# EAGLE design Lora G v1.3 (EAGLE 7.5.0)

## Sheet 1 of 2
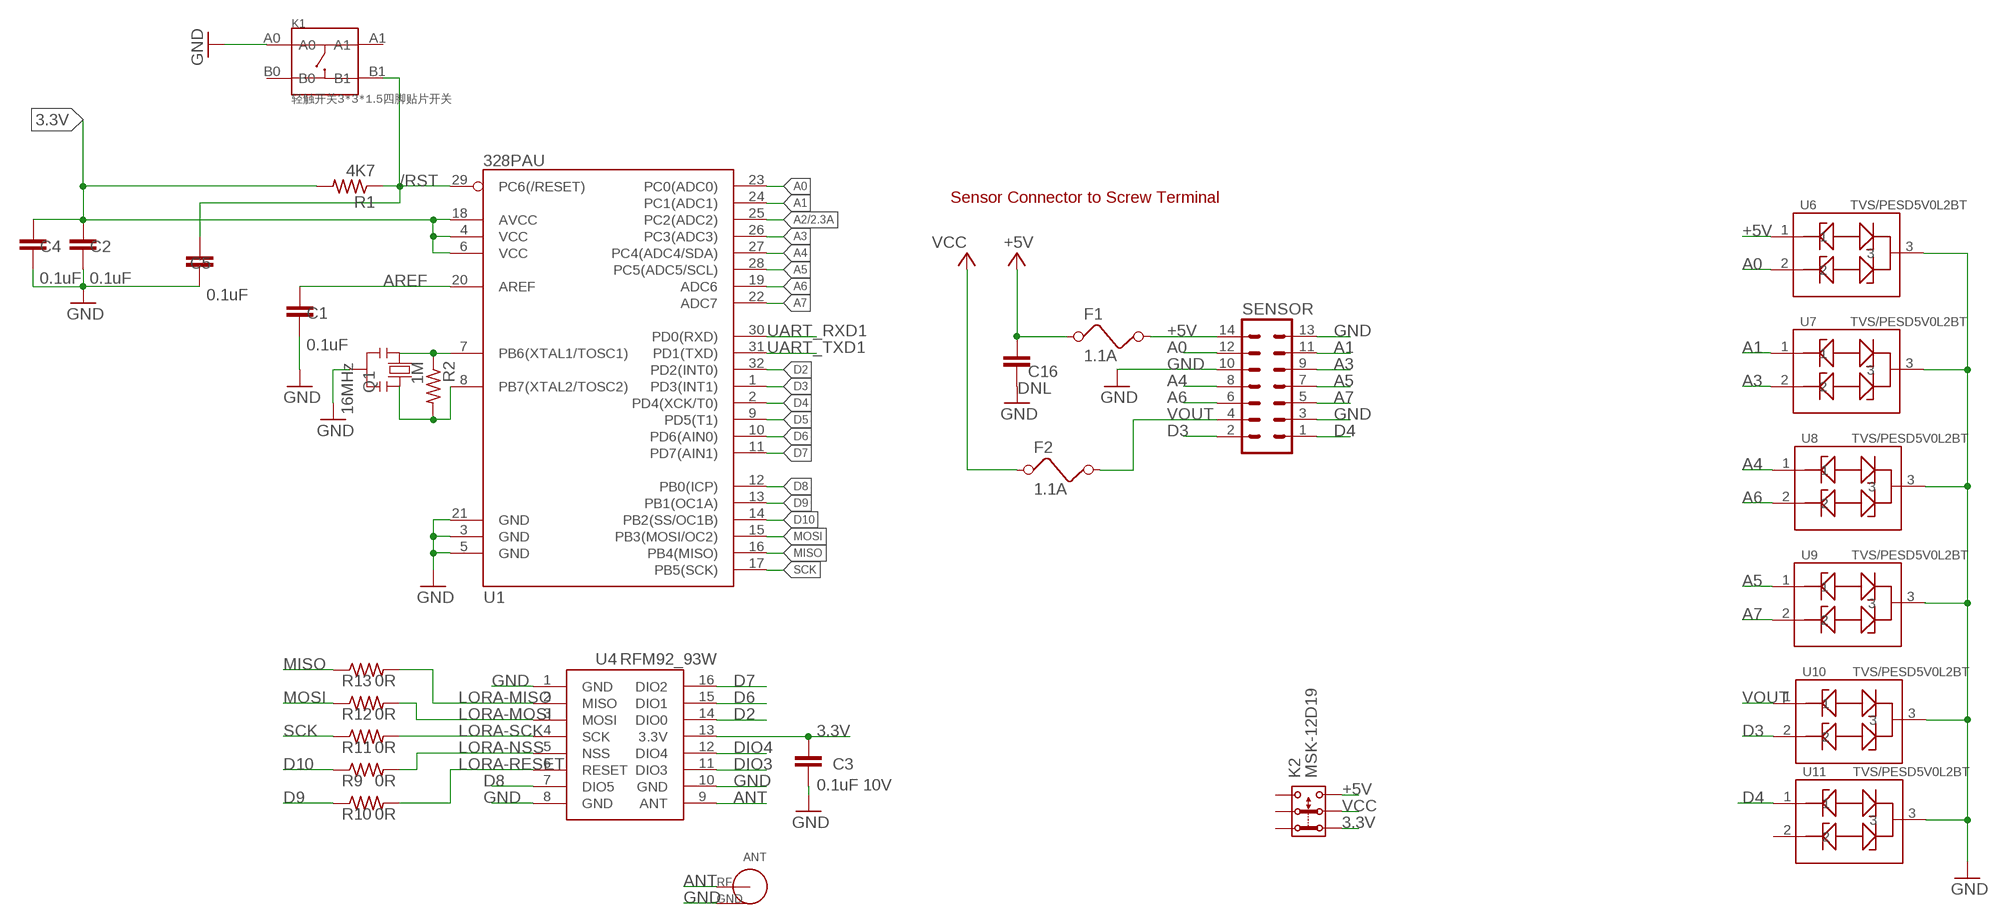
[diagram p0: schematic, sheet 1]

### Parts
ANT  I-PEX  [I-PEX]
C1  0.1uF  C-EUC0402  [C0402]
C2  0.1uF  C-EUC0402  [C0402]
C3  0.1uF 10V  C-EUC0402  [C0402]
C4  0.1uF  C-EUC0402  [C0402]
C5  0.1uF  C-EUC0402  [C0402]
C16  DNL  C-EUC0402  [C0402]
F1  1.1A  FUSE1812  [L1812]
F2  1.1A  FUSE1812  [L1812]
K1  轻触开关3*3*1.5四脚贴片开关  BUTTON-4P-3.3X3.3  [SW4-SMD-3.35X3.35X1.5MM]
K2  MSK-12D19  [MSK-12D19]
Q1  16MHz  RESONATORMU  [RESONATOR]
R1  4K7  R-US_R0402  [R0402]
R2  1M  R-US_R0402  [R0402]
R9  0R  R-US_R0402  [R0402]
R10  0R  R-US_R0402  [R0402]
R11  0R  R-US_R0402  [R0402]
R12  0R  R-US_R0402  [R0402]
R13  0R  R-US_R0402  [R0402]
SENSOR  MA07-2  [MA07-2]
U1  328PAU  [328PAU]
U4  RFM92_93W  [RFM92_93W]
U6  TVS/PESD5V0L2BT  [SOT23]
U7  TVS/PESD5V0L2BT  [SOT23]
U8  TVS/PESD5V0L2BT  [SOT23]
U9  TVS/PESD5V0L2BT  [SOT23]
U10  TVS/PESD5V0L2BT  [SOT23]
U11  TVS/PESD5V0L2BT  [SOT23]

### Nets
3.3V: C2.2 C3.2 C4.2 K2.1.2 R1.2 U1.4(VCC) U1.6(VCC) U1.18(AVCC) U4.13(3.3V) ; also sheet 2
+5V: C16.1 F1.1 K2.3.2 U6.1 ; also sheet 2
/RST: C5.2 K1.B1 R1.1 U1.29(PC6(/RESET)) ; also sheet 2
A0: SENSOR.12 U1.23(PC0(ADC0)) U6.2
A1: SENSOR.11 U1.24(PC1(ADC1)) U7.1
A2: U1.25(PC2(ADC2)) ; also sheet 2
A3: SENSOR.9 U1.26(PC3(ADC3)) U7.2
A4: SENSOR.8 U1.27(PC4(ADC4/SDA)) U8.1
A5: SENSOR.7 U1.28(PC5(ADC5/SCL)) U9.1
A6: SENSOR.6 U1.19(ADC6) U8.2
A7: SENSOR.5 U1.22(ADC7) U9.2
ANT [2layer-50ohm]: ANT.SIG U4.9(ANT)
AREF: C1.2 U1.20(AREF)
D2: U1.32(PD2(INT0)) U4.14(DIO0)
D3: SENSOR.2 U1.1(PD3(INT1)) U10.2
D4: SENSOR.1 U1.2(PD4(XCK/T0)) U11.1
D5: U1.9(PD5(T1)) ; also sheet 2
D6: U1.10(PD6(AIN0)) U4.15(DIO1)
D7: U1.11(PD7(AIN1)) U4.16(DIO2)
D8: U1.12(PB0(ICP)) U4.7(DIO5)
D9: R10.1 U1.13(PB1(OC1A))
D10: R9.1 U1.14(PB2(SS/OC1B)) ; also sheet 2
DIO3: U4.11(DIO3)
DIO4: U4.12(DIO4)
GND [vcc]: ANT.GND ANT.GND1(GND) C1.1 C2.1 C3.1 C4.1 C5.1 C16.2 K1.A0 Q1.2 SENSOR.3 SENSOR.10 SENSOR.13 U1.3(GND) U1.5(GND) U1.21(GND) U4.1(GND) U4.8(GND) U4.10(GND) U6.3 U7.3 U8.3 U9.3 U10.3 U11.3 ; also sheet 2
LORA-MISO: R13.2 U4.2(MISO)
LORA-MOSI: R12.2 U4.3(MOSI)
LORA-NSS: R9.2 U4.5(NSS)
LORA-RESET: R10.2 U4.6(RESET)
LORA-SCK: R11.2 U4.4(SCK)
MISO: R13.1 U1.16(PB4(MISO)) ; also sheet 2
MOSI: R12.1 U1.15(PB3(MOSI/OC2)) ; also sheet 2
N$1: Q1.3 R2.2 U1.8(PB7(XTAL2/TOSC2))
N$2: Q1.1 R2.1 U1.7(PB6(XTAL1/TOSC1))
N$5: F1.2 SENSOR.14
SCK: R11.1 U1.17(PB5(SCK)) ; also sheet 2
UART_RXD1: U1.30(PD0(RXD)) ; also sheet 2
UART_TXD1: U1.31(PD1(TXD)) ; also sheet 2
VCC: F2.1 K2.2.2
VOUT: F2.2 SENSOR.4 U10.1
Unconnected: K1.A1 K1.B0 K2.1.1 K2.2.1 K2.3.1 U11.2

### Notes on the sheet
- Sensor Connector to Screw Terminal

## Sheet 2 of 2
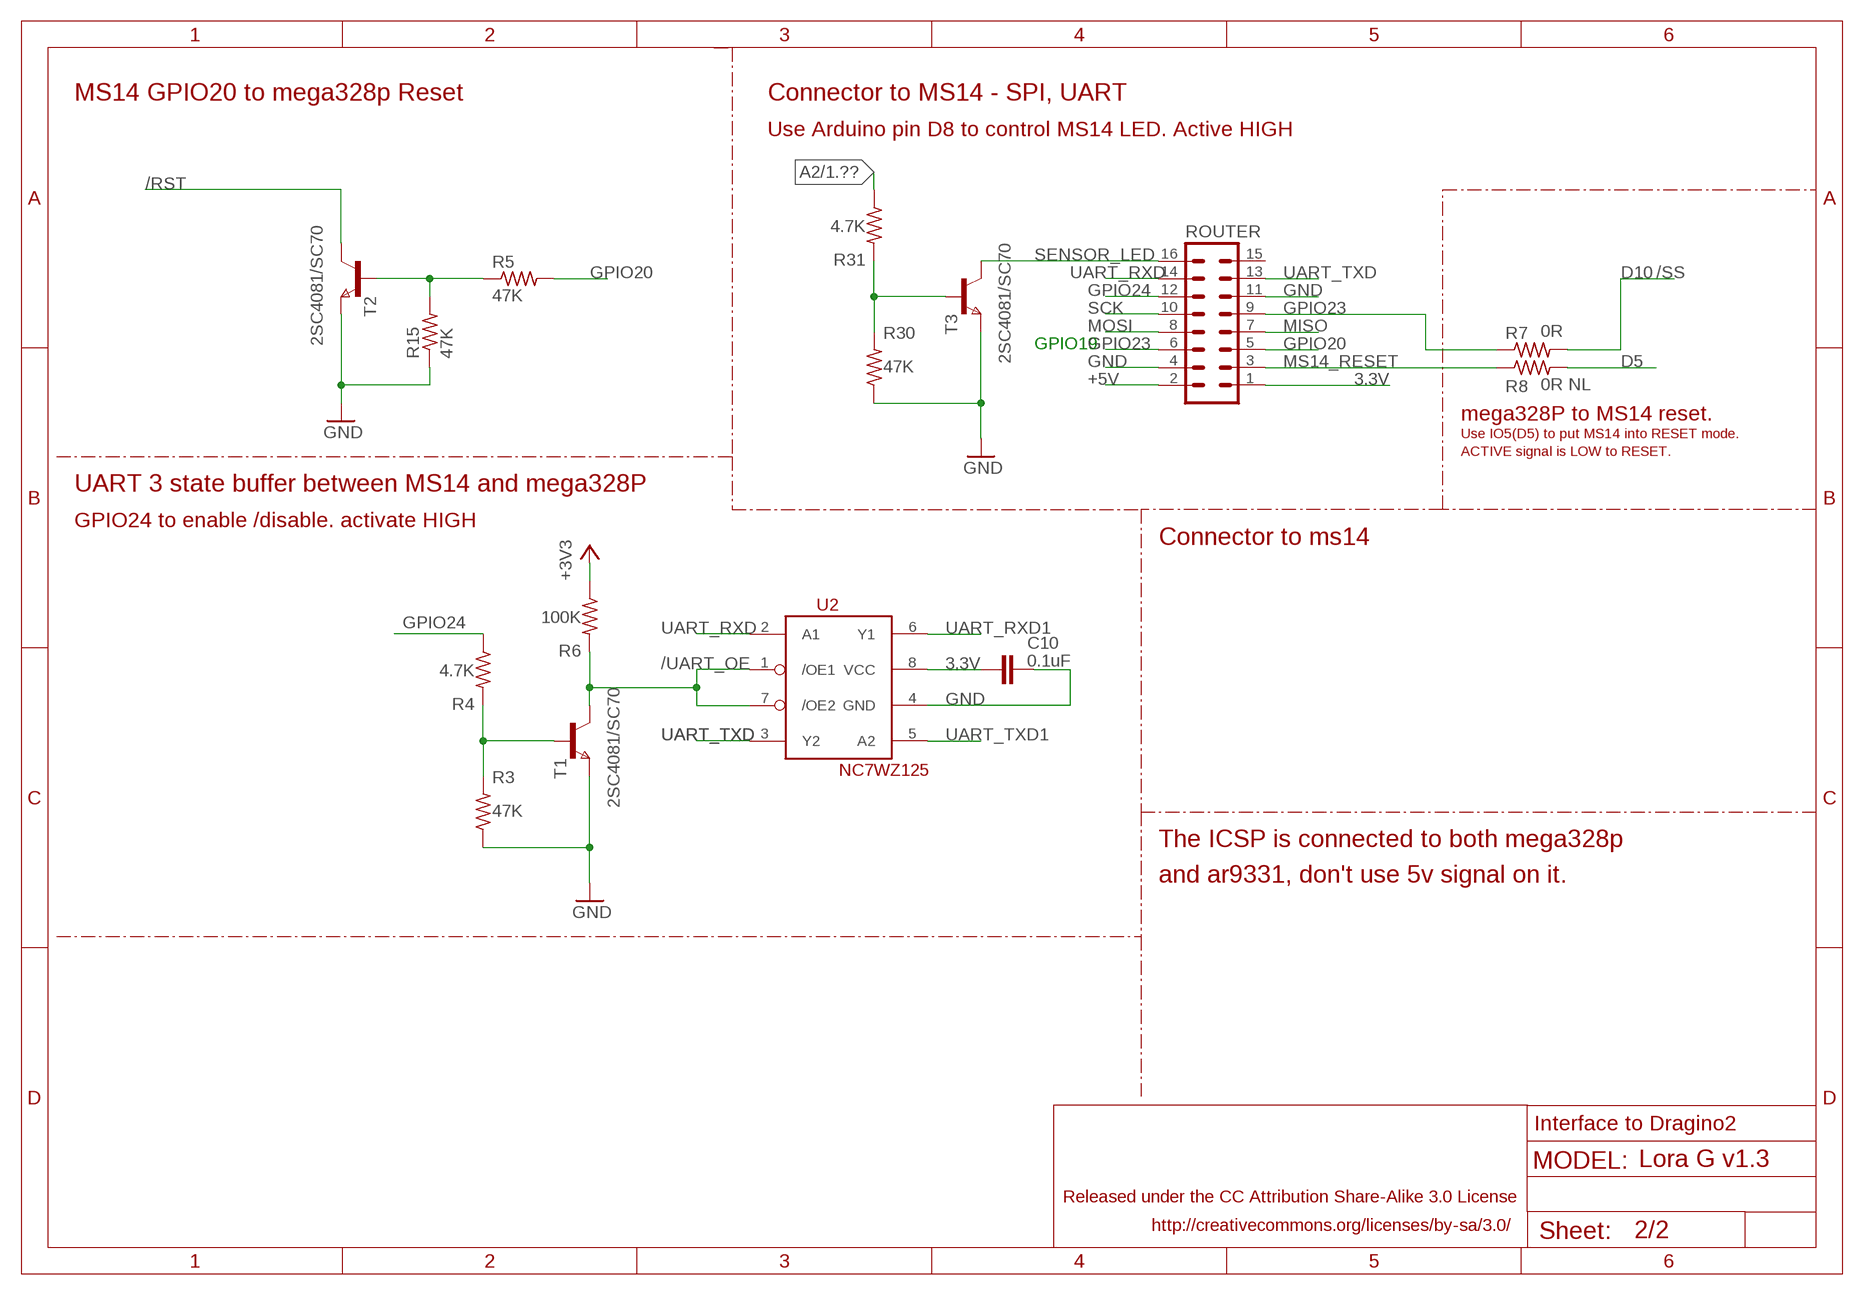
[diagram p1: schematic, sheet 2]

### Parts
C10  0.1uF  C-EUC0402  [C0402]
R3  47K  R-US_R0402  [R0402]
R4  4.7K  R-US_R0402  [R0402]
R5  47K  R-US_R0402  [R0402]
R6  100K  R-US_R0402  [R0402]
R7  0R  R-US_R0402  [R0402]
R8  0R NL  R-US_R0805  [R0805]
R15  47K  R-US_R0402  [R0402]
R30  47K  R-US_R0402  [R0402]
R31  4.7K  R-US_R0402  [R0402]
ROUTER  MA08-2  [MA08-2]
T1  2SC4081/SC70  NPNSOT323  [SOT323]
T2  2SC4081/SC70  NPNSOT323  [SOT323]
T3  2SC4081/SC70  NPNSOT323  [SOT323]
U2  NC7WZ125  [US8]

### Nets
3.3V: C10.2 R6.1 ROUTER.1 U2.8(VCC) ; supply symbol labelled +3V3 ; also sheet 1
+5V: ROUTER.2 ; also sheet 1
/RST: T2.1(C) ; also sheet 1
/UART_OE: R6.2 T1.1(C) U2.1(/OE1) U2.7(/OE2)
A2: R31.1 ; also sheet 1
D5: R8.2 ; also sheet 1
D10: R7.2 ; also sheet 1
GND [vcc]: C10.1 R3.1 R15.1 R30.1 ROUTER.4 ROUTER.11 T1.3(E) T2.3(E) T3.3(E) U2.4(GND) ; also sheet 1
GPIO20: R5.2 ROUTER.5
GPIO23: R7.1 ROUTER.6 ROUTER.9
GPIO24: R4.1 ROUTER.12
MISO: ROUTER.7 ; also sheet 1
MOSI: ROUTER.8 ; also sheet 1
MS14_RESET: R8.1 ROUTER.3
N$4: R3.2 R4.2 T1.2(B)
N$8: R5.1 R15.2 T2.2(B)
N$9: R30.2 R31.2 T3.2(B)
SCK: ROUTER.10 ; also sheet 1
SENSOR_LED: ROUTER.16 T3.1(C)
UART_RXD: ROUTER.14 U2.2(A1)
UART_RXD1: U2.6(Y1) ; also sheet 1
UART_TXD: ROUTER.13 U2.3(Y2)
UART_TXD1: U2.5(A2) ; also sheet 1
Unconnected: ROUTER.15

### Notes on the sheet
- MS14 GPIO20 to mega328p Reset | Connector to MS14 - SPI, UART
- Use Arduino pin D8 to control MS14 LED. Active HIGH
- /SS
- GPIO19
- mega328P to MS14 reset.
- Use IO5(D5) to put MS14 into RESET mode.
- ACTIVE signal is LOW to RESET.
- UART 3 state buffer between MS14 and mega328P
- GPIO24 to enable /disable. activate HIGH
- Connector to ms14
- The ICSP is connected to both mega328p
- and ar9331, don't use 5v signal on it.
- Interface to Dragino2

## Library data of the parts
ANT = dragino-passive:I-PEX: I-PEX, U.F.L connector
C1-C5 = dragino-passive:C-EU: CAPACITOR, European symbol
C10 C16 = dragino:C-EU: CAPACITOR, European symbol
F1 F2 = dragino:FUSE: FUSE 5 x 20 mm
K1 = dragino:BUTTON-4P: SW4-6.0X6.0X5.0MM:311020024;SW4-8.0X8.0X9.0MM:311020028;SW4-SMD-6.0X6.0X5.0MM:311020004;SW4-SMD-3.35X3.35X1.5MM:311020030;SW4-SMD-5.2X5.2X2.5MM:311020046
K2 = dragino1:MSK-12D19
Q1 = SmartPrj:RESONATOR
R1-R13 R15 R30 R31 = dragino:R-US_: RESISTOR, American symbol
ROUTER = dragino:MA08-2: PIN HEADER; OC_FARNELL: unknown; OC_NEWARK: unknown
SENSOR = dragino:MA07-2: PIN HEADER; OC_FARNELL: unknown; OC_NEWARK: unknown
T1-T3 = zetex:NPNSOT323: NPN TRANSISTOR; MPN: DSS4160U-7; OC_FARNELL: 1710696; OC_NEWARK: 25R4558
U1 = 328PAU:328PAU
U2 = dragino:NC7WZ125: 3 state buffer: http://www.fairchildsemi.com/ds/NC/NC7WZ125.pdf
U4 = dragino:RFM92_93W
U6-U11 = dragino-passive:TVS/PESD5V0L2BT

## Net classes
0 default: width 0.203 mm, clearance 0.203 mm
1 vcc: width 0.254 mm
2 gnd: width 0.305 mm, drill 0.254 mm, clearance 0.203 mm
3 2layer-50ohm: width 1 mm, clearance 0.2 mm

## Board
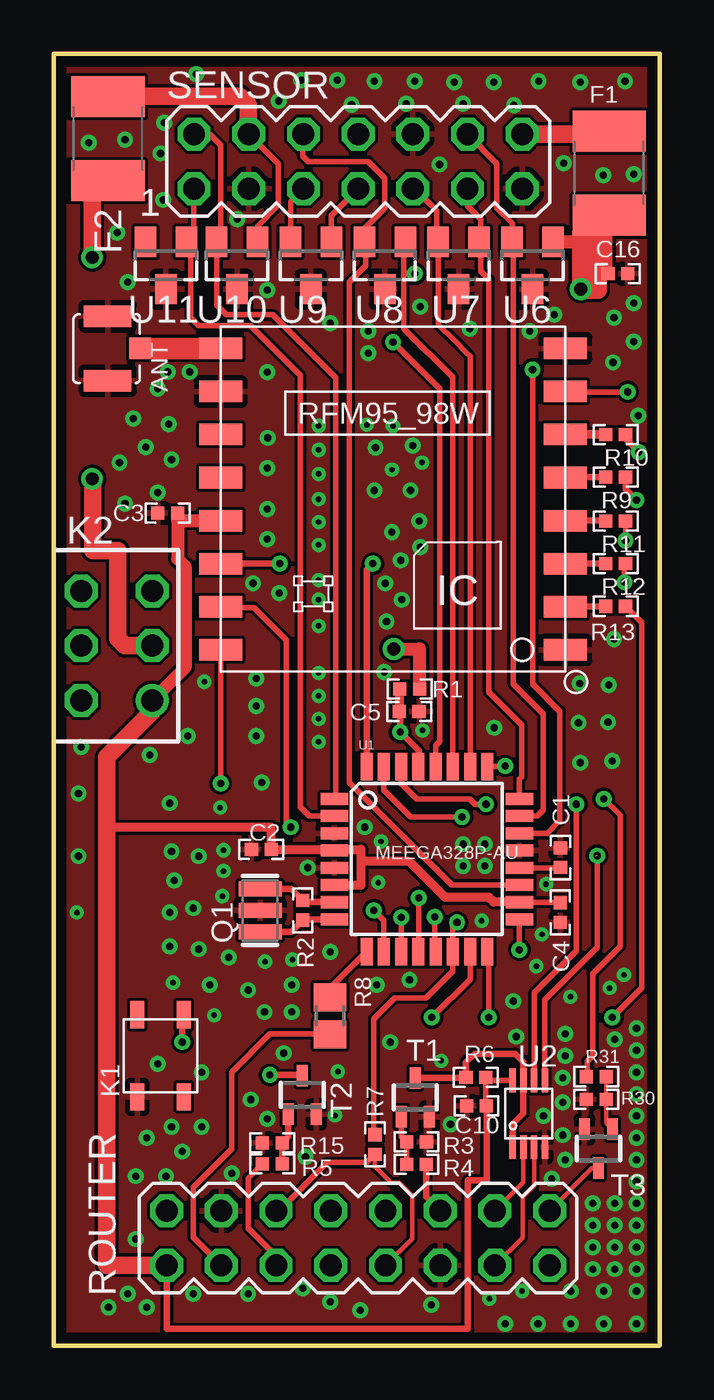
[diagram p2: board, top side]
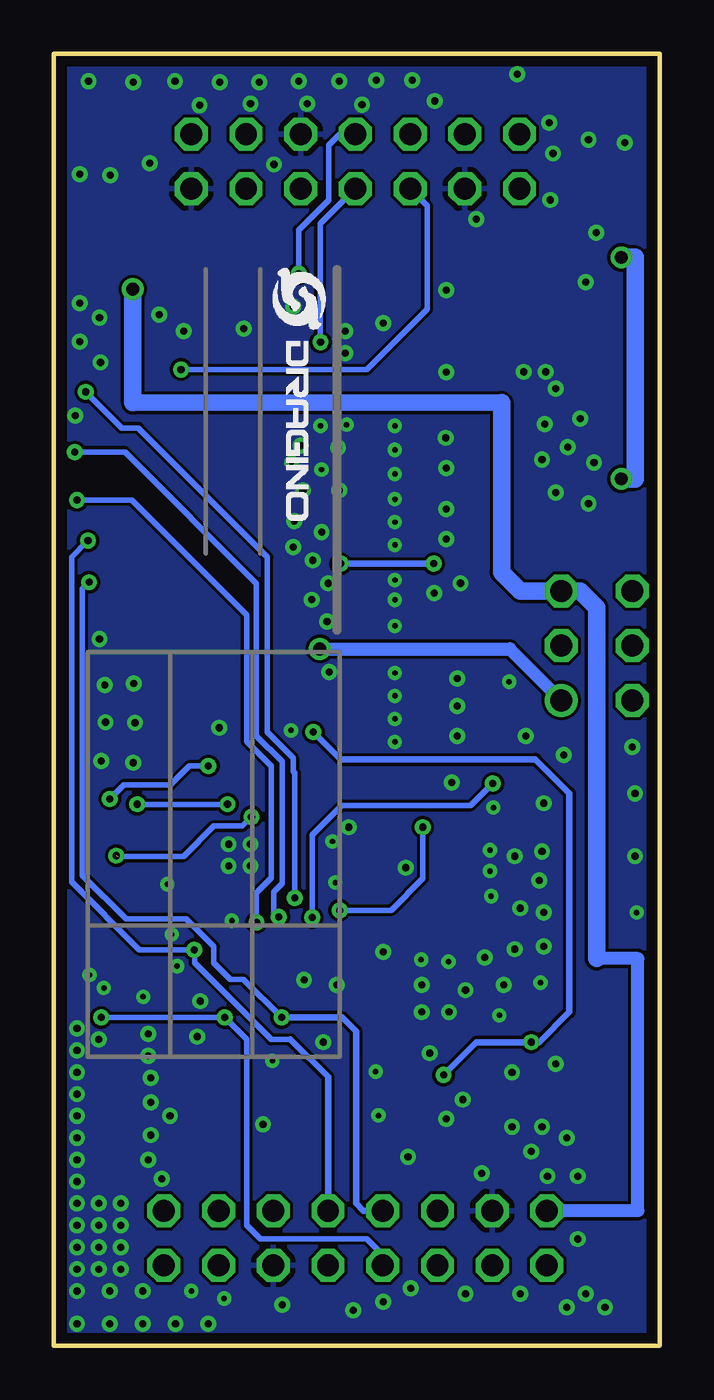
[diagram p3: board, bottom side, seen from below]

Size 28.13 x 60 mm. Coordinates in mm from the lower left corner, seen from the top.
Outline: 0,0 0,60 28.13,60 28.13,0 0,0
Copper layers (1*16): Top 0.035mm / dielectric 1.5mm / Bottom 0.035mm
Design rules "default *": minimum track width 6mil, minimum drill 10mil, track to track 6mil, track to pad 6mil, pad to pad 6mil, via to via 6mil, smd to smd 6mil, copper to edge 0.5mm, drill to drill 8mil, minimum pad ring 10mil, minimum via ring 8mil, stop-mask expansion 4mil, vias tented up to drill 30mil, thermal gap 10mil

### Footprints (pad centres in the part's own frame; a part is rotated, then mirrored left to right if it is on the bottom)
I-PEX = smd 1 x 2.2: GND -1.65,-0.27; GND1 1.35,-0.27 | smd 1 x 1: SIG -0.15,-1.77
C0402 = smd 0.61 x 0.61: 1 -0.457,0; 2 0.457,0
L1812 = smd 1.9 x 3.4: 1 -1.95,0; 2 1.95,0
SW4-SMD-3.35X3.35X1.5MM = smd 1.27 x 0.635: A0 -1.905,1.079; A1 1.905,1.079; B0 -1.905,-1.079; B1 1.905,-1.079
MSK-12D19 = drill 1.016 octagon: 1.1 -5.08,1.27; 2.1 -2.54,1.27; 2.2 -2.54,-2.03; 3.1 0,1.27; 3.2 0,-2.03 | drill 1.016: 1.2 -5.08,-2.03
RESONATOR = smd 0.7 x 2: 1 -1,0; 2 0,0; 3 1,0
R0402 = smd 0.61 x 0.61: 1 -0.457,0; 2 0.457,0
R0805 = smd 1.3 x 1.5: 1 -0.85,0; 2 0.85,0
MA08-2 = drill 1.016 octagon: 1 -8.89,-1.27; 2 -8.89,1.27; 3 -6.35,-1.27; 4 -6.35,1.27; 5 -3.81,-1.27; 6 -3.81,1.27; 7 -1.27,-1.27; 8 -1.27,1.27; 9 1.27,-1.27; 10 1.27,1.27; 11 3.81,-1.27; 12 3.81,1.27; 13 6.35,-1.27; 14 6.35,1.27; 15 8.89,-1.27; 16 8.89,1.27
MA07-2 = drill 1.016 octagon: 1 -7.62,-1.27; 2 -7.62,1.27; 3 -5.08,-1.27; 4 -5.08,1.27; 5 -2.54,-1.27; 6 -2.54,1.27; 7 0,-1.27; 8 0,1.27; 9 2.54,-1.27; 10 2.54,1.27; 11 5.08,-1.27; 12 5.08,1.27; 13 7.62,-1.27; 14 7.62,1.27
SOT323 = smd 0.5 x 1: 1 0,0.9; 2 -0.65,-0.9; 3 0.65,-0.9
328PAU = smd 1.27 x 0.559: 1 -4.293,2.8; 2 -4.293,2; 3 -4.293,1.2; 4 -4.293,0.4; 5 -4.293,-0.4; 6 -4.293,-1.2; 7 -4.293,-2; 8 -4.293,-2.8; 17 4.293,-2.8; 18 4.293,-2; 19 4.293,-1.2; 20 4.293,-0.4; 21 4.293,0.4; 22 4.293,1.2; 23 4.293,2; 24 4.293,2.8 | smd 0.559 x 1.27: 9 -2.8,-4.293; 10 -2,-4.293; 11 -1.2,-4.293; 12 -0.4,-4.293; 13 0.4,-4.293; 14 1.2,-4.293; 15 2,-4.293; 16 2.8,-4.293; 25 2.8,4.293; 26 2,4.293; 27 1.2,4.293; 28 0.4,4.293; 29 -0.4,4.293; 30 -1.2,4.293; 31 -2,4.293; 32 -2.8,4.293
US8 = smd 0.3 x 1.1: 1 -0.75,-1.55; 2 -0.25,-1.55; 3 0.25,-1.55; 4 0.75,-1.55; 5 0.75,1.55; 6 0.25,1.55; 7 -0.25,1.55; 8 -0.75,1.55
RFM92_93W = smd 2 x 1: 1 -8,7; 2 -8,5; 3 -8,3; 4 -8,1; 5 -8,-1; 6 -8,-3; 7 -8,-5; 8 -8,-7; 9 8,-7; 10 8,-5; 11 8,-3; 12 8,-1; 13 8,1; 14 8,3; 15 8,5; 16 8,7
SOT23 = smd 1 x 1.4: 1 -0.95,-1.1; 2 0.95,-1.1; 3 0,1.1

### Placement (x,y rotation side)
ANT  2.23,46.47 90 top
C1  23.52,22.66 270 top
C2  9.63,23.05 0 top
C3  5.29,38.67 0 top
C4  23.52,20.12 90 top
C5  16.5,29.45 180 top
C10  19.63,11.13 0 top
C16  26.19,49.78 0 top
F1  25.78,54.46 90 top
F2  2.51,56.06 90 top
K1  4.95,13.46 90 top
K2  2.54,35.05 90 top
Q1  9.58,20.22 270 top
R1  16.52,30.5 0 top
R2  11.56,20.22 270 top
R3  16.84,9.47 180 top
R4  16.84,8.43 180 top
R5  10.14,8.44 180 top
R6  19.59,12.45 180 top
R7  14.91,9.35 90 top
R8  12.83,15.32 90 top
R9  26.09,40.34 180 top
R10  26.09,42.32 180 top
R11  26.09,38.3 180 top
R12  26.09,36.32 180 top
R13  26.09,34.34 180 top
R15  10.14,9.42 0 top
R30  25.18,11.45 0 top
R31  25.18,12.49 0 top
ROUTER  14.13,5 0 top
SENSOR  14.13,55 0 top
T1  16.78,11.54 0 top
T2  11.53,11.65 0 top
T3  25.29,9.15 180 top
U1  17.32,22.6 0 top
U2  22.05,10.77 0 top
U4  15.74,39.32 180 top
U6  22.22,50.16 180 top
U7  18.8,50.16 180 top
U8  15.37,50.16 180 top
U9  11.94,50.16 180 top
U10  8.51,50.16 180 top
U11  5.21,50.16 180 top
U$1  [LOGO-SILK-NEW]  17.96,50.04 270 bottom

### Tracks (layer width: path | path; a pad name or v marks a point on that pad's centre or on a via)
3.3V  (via drill 0.61)
  Top 0.254: 20.05,11.17 R6.1 | 20.06,12.32 U2.8 | C4.2 21.64,20.58 U1.18
  Top 0.305: C10.2 20.05,11.17 | ROUTER.1 5.24,0.79 19.23,0.79 19.23,7.67 20.09,7.67 C10.2 | R6.1 20.05,12.33 20.06,12.32
  Top 0.406: 12.98,23.05 C2.2 10.09,24.08 2.53,24.08 2.46,24 | 12.98,23.05 U1.4 | 12.98,23.05 14.25,23.05 14.25,22.48 | 14.25,22.48 14.25,21.39 13.03,21.39 U1.6 | C10.2 | U1.18 20.42,20.6 20.19,20.83 18.16,20.83 16.51,22.48 14.25,22.48
  Top 0.61: U4.13 5.75,38.32 C3.2 5.75,36.55 6.1,36.2 6.1,31.5 K2.1.2 | R1.2 16.98,32.36 v15.77,32.36
  Top 0.813: ROUTER.1 2.46,3.73 2.46,24 2.46,27.35 4.57,29.46 K2.1.2
  Bottom 0.61: v15.77,32.36 6.96,32.36 K2.1.2
+5V  (via drill 0.6)
  Top 0.254: C16.1 25.73,49.99
  Top 0.406: C16.1 25.73,52.07 25.73,52.51 F1.1
  Top 0.61: U6.1 24.59,51.27 24.64,51.31
  Top 0.813: v24.46,49.07 24.46,51.69 24.64,51.69 24.64,51.31 24.64,49.02 25.27,49.02 25.27,51.56 25.15,51.56 25.15,52.07 25.73,52.07
  Bottom 0.61: 2.92,17.98 1.02,17.98 1.02,6.27 ROUTER.2
  Bottom 0.762: 24.46,43.79 7.34,43.79
  Bottom 0.813: 2.92,17.98 2.92,34.29 3.68,35.05 K2.3.2 6.48,35.05 7.34,35.92 7.34,43.79 | 24.46,43.79 v24.46,49.07
/RST  (via drill 0.33)
  Top 0.305: U1.29 16.92,27.41 16.94,27.43 16.94,27.64 v16.08,28.5 16.08,29.41 C5.2 | v10.03,12.57 11.51,12.57 T2.1 | K1.B1 5.97,15.3 v5.97,14.1
  Top 0.406: C5.2 16.07,29.47 R1.1
  Bottom 0.305: v16.08,28.5 14.81,27.23 5.77,27.23 4.19,25.65 4.19,15.49 5.59,14.1 v5.97,14.1 8.51,14.1 v10.03,12.57
/UART_OE
  Top 0.305: U2.1 21.3,10.3 21.8,10.8 U2.7 21.8,13.18 21.41,13.56 19.53,13.56 19.13,13.17 R6.2 19.12,12.44 T1.1
A0
  Top 0.254: SENSOR.12 20.57,54.9 20.57,52.83 21.27,52.13 U6.2 21.34,51.2 21.34,30.73 22.73,29.34 22.73,24.89 22.44,24.6 U1.23
A1
  Top 0.254: U1.24 21.61,26.31 21.72,26.42 21.72,28.83 20.19,30.35 20.19,49.53 19.81,49.91 19.81,51.2 U7.1 19.81,51.33 19.81,52.32 19.21,52.93 SENSOR.11
A2  (via drill 0.33)
  Top 0.254: U1.25 20.92,26.89 v20.95,26.92 | v25.53,25.4 26.29,24.64 26.29,18.54 25.02,17.27 25.02,13.46 24.77,13.21 24.77,12.53 R31.1
  Bottom 0.254: v20.95,26.92 21.84,26.92 22.73,26.04 24.89,26.04 v25.53,25.4
A3
  Top 0.254: SENSOR.9 16.75,53.73 17.78,52.7 17.78,51.33 U7.2 17.85,47.43 18.61,46.67 19.18,46.1 19.32,45.96 U1.26
A4  (via drill 0.33)
  Top 0.254: U1.27 18.52,44.98 16.26,47.24 16.26,49.78 | 16.26,49.78 16.26,51.2 U8.1 | v16.76,49.78 16.26,49.78
  Bottom 0.254: SENSOR.8 14.85,56.27 15.37,55.75 15.37,53.21 16.76,51.82 v16.76,49.78
A5  (via drill 0.33)
  Top 0.254: U9.1 12.89,52.49 SENSOR.7 | U1.28 17.72,27.88 17.91,28.07 17.91,44.45 v15.75,46.61
  Bottom 0.254: v15.75,46.61 15.75,52.11 SENSOR.7
A6
  Top 0.254: SENSOR.6 11.56,56.24 11.56,55.24 11.81,54.99 14.61,54.99 15.37,54.23 15.37,52.83 14.42,51.88 U8.2 14.48,51.2 14.48,50.16 13.72,49.4 13.72,26.16 18.48,21.4 U1.19
A7  (via drill 0.33)
  Top 0.254: U9.2 10.99,53.13 SENSOR.5 | U1.22 22.91,23.8 23.49,24.38 23.49,29.46 22.22,30.73 v22.22,45.34
  Bottom 0.254: v22.22,45.34 13.59,45.34 10.79,48.13 10.79,52.94 SENSOR.5
ANT
  Top 1: U4.9 ANT.SIG
AREF
  Top 0.254: U1.20 23.52,22.2 C1.2
D2  (via drill 0.33)
  Top 0.305: U1.32 14.52,36.04 v14.81,36.32 | v10.49,36.32 U4.14
  Bottom 0.305: v14.81,36.32 v10.49,36.32
D3
  Top 0.254: SENSOR.2 7.23,56.27 7.75,55.75 7.75,51.45 U10.2 7.56,48.32 8,47.88 10.16,47.88 13.08,44.96 13.08,25.45 U1.1
D4
  Top 0.254: U1.2 11.85,24.6 11.43,25.02 11.43,45.09 9.14,47.37 6.73,47.37 6.35,47.75 6.35,51.07 U11.1 6.51,51.62 SENSOR.1
D5
  Top 0.254: U1.9 12.83,16.61 R8.2
D6  (via drill 0.33)
  Top 0.254: U1.10 15.32,19.75 v14.86,20.22 | 7.76,34.34 U4.15 7.77,34.29 9.27,34.29 10.79,32.77 10.79,24.28 v11,24.08
  Bottom 0.254: v11,24.08 11,21.69 12.47,20.22 v14.86,20.22
D7  (via drill 0.33)
  Top 0.254: U1.11 v16.13,19.89 | v7.75,26.11 U4.16
  Bottom 0.254: v7.75,26.11 8.76,25.09 14.76,25.09 16.13,23.72 v16.13,19.89
D8  (via drill 0.33)
  Top 0.254: U1.12 16.94,18.33 v16.94,20.8 | v26.64,44.3 23.76,44.3 U4.7
  Bottom 0.254: v26.64,44.3 24.97,42.62 24.21,42.62 18.21,36.63 18.21,28.5 17.02,27.3 17.02,26.67 16.94,26.59 v16.94,20.8
D9  (via drill 0.33)
  Top 0.254: U1.13 17.68,18.35 v17.68,19.91
  Top 0.305: R10.1 26.54,42.11 v27.15,41.5
  Bottom 0.254: v27.15,41.5 24.82,41.5 18.72,35.41 18.72,28.32 17.53,27.13 17.53,21.46 17.91,21.08 17.91,20.14 v17.68,19.91
D10  (via drill 0.33)
  Top 0.254: R7.2 14.86,9.86 14.86,15.19 15.82,16.15 17.3,16.15 18.52,17.37 18.52,17.73 U1.14 18.52,18.95 18.52,18.96 18.52,19.46 v18.72,19.66
  Top 0.305: R9.1 26.54,39.78 v27.05,39.27
  Bottom 0.254: v27.05,39.27 24.51,39.27 19.18,33.93 19.18,28.07 18.03,26.92 18.03,21.72 18.72,21.03 v18.72,19.66
GND  (via drill 0.25, 0.33)
  other vias: 3.68,43.05 12.83,18.29 9.02,16.51 7.24,16.76 8.13,18.03 9.78,15.49 11.05,16.76 11.05,15.49 3.81,7.87 5.21,7.87 11.68,8.76 9.91,10.54 9.14,11.43 27.05,1.02 25.53,1.02 24,1.02 22.48,1.02 20.95,1.02 27.05,2.54 25.53,2.54 24,2.54 27.05,3.56 26.04,3.56 25.02,3.56 25.02,4.57 26.04,4.57 27.05,4.57 27.05,5.59 26.04,5.59 25.02,5.59 25.02,6.6 26.04,6.6 27.05,6.6 27.05,7.62 27.05,8.64 27.05,9.65 27.05,10.67 27.05,11.68 27.05,12.7 27.05,13.72 27.05,14.73 26.04,14.22 23.75,14.48 23.75,13.46 23.62,12.45 23.62,11.3 22.73,10.67 23.62,9.78 23.75,8.64 23.11,7.75 3.43,2.41 2.54,1.78 4.32,1.78 3.81,4.95 6.48,2.41 18.41,10.29 15.62,14.1 16.51,16.99 4.27,41.73 6.6,59.05 4.95,55.37 5.08,53.21 3.43,49.4 4.83,44.45 5.33,42.8 3.05,41.02 5.46,41.15 3.3,39.12 4.83,39.62 9.93,42.16 9.91,40.77 9.91,38.86 9.4,30.99 9.4,29.72 9.4,28.32 9.65,26.16 9.25,35.41 10.46,34.95 5.38,25.2 5.46,22.96 5.59,21.62 5.38,20.12 5.38,18.54 11.79,22.2 14.43,24.08 15.34,31.29 15.44,33.63 15.39,35.41 16.15,34.65 16.1,36.47 17.02,37.08 16.97,38.3 15.7,37.8 14.88,39.73 16.56,39.73 14.94,41.71 16.66,41.81 26.01,47.75 26.92,48.41 26.92,46.63 25.96,45.67 27.13,43.21 24.36,28.93 24.41,30.76 24.43,27.08 26.01,32.82 25.76,30.68 25.73,28.96 25.93,27.15 20.02,22.28 22.86,21.44 22.66,19.1 22.4,17.63 23.98,16.21 25.81,16.61 26.47,17.22 13.06,10.69 7.72,24.99 12.29,28.04 12.29,29.11 12.29,30.18 12.29,31.24 6.98,30.84 26.92,54.41 25.5,54.36 23.67,54.91 2.95,51.69 1.63,55.88 3.3,56.01 5.13,56.79 11.48,58.78 13.16,58.78 14.88,58.72 16.76,58.72 18.59,58.67 20.42,58.67 22.5,58.72 24.43,58.67 26.52,58.72 21.36,57.61 19,57.68 16.36,57.68 13.82,57.63 10.44,57.81 15.19,23.42 1.07,20.12 7.87,23.01 7.87,22.05 7.82,20.88 5.54,16.87 9.8,17.83 11.07,17.93 7.44,15.34 21.74,2.54 20.22,2.18 17.98,13.23 12.29,33.43 12.29,34.65 12.29,35.56 12.29,37.19 12.29,38.25 12.29,39.32 12.29,40.49 12.29,41.61 12.29,42.72 15.7,40.69 17.09,41.02 15.75,42.72 14.53,42.77 17.12,28.57 19,23.29 20.02,23.29 19,22.28 14.99,16.76 21.46,14.35 21.34,16 15.06,21.51 19.86,19.74 13.18,12.73 9.02,2.41 11.56,2.67 12.83,2.03 5.3,45.23 6.31,45.23 1.14,22.73 1.14,25.65 6.73,18.41 6.48,20.32 6.73,22.73 6.22,28.32 4.44,27.43 1.27,27.81 4.32,9.65 6.86,10.16 4.83,13.08 6.86,12.7 14.22,1.65 17.53,1.91 5.97,9.02 14.61,46.1 8.51,52.32 9.91,45.21 17.91,54.86 17.02,48.26 14.61,47.12 12.83,47.5 9.91,49.02 19.3,47.24 22.1,47.12 23.24,47.88 9.91,37.47 20.45,28.7 10.67,13.59 8.26,8 5.46,10.16
  pour Top: 29.21,-1 -1.14,-1 -1.14,61.1 29.51,61.1
  pour Bottom: 29.21,-1 -1.45,-0.9 -1.15,61.2 29.51,61.1
GPIO20
  Top 0.254: R5.2 9.02,7.77 9.02,5.46 10.32,4.16 ROUTER.5
GPIO23
  Top 0.203: ROUTER.9 16.64,4.97 16.64,6.96 16.03,7.57 15.67,7.57 14.91,8.33 R7.1
  Top 0.254: ROUTER.6 10.46,6.27 12.7,8.51 14.53,8.51 R7.1
GPIO24
  Top 0.305: ROUTER.12 17.3,6.91 R4.1
LORA-MISO
  Top 0.305: U4.2 25.61,34.32 R13.2
LORA-MOSI
  Top 0.305: U4.3 R12.2
LORA-NSS
  Top 0.305: R9.2 23.76,40.34 U4.5
  Top 0.406: 23.74,40.18 U4.5
LORA-RESET
  Top 0.406: 23.74,42.42 U4.6 R10.2
LORA-SCK
  Top 0.305: U4.4 25.61,38.32 R11.2
MISO  (via drill 0.33)
  Top 0.254: R13.1 27.3,33.58 27.3,16.61 v25.93,15.24 | v20.19,15.24 20.19,18.24 U1.16
  Bottom 0.254: 25.91,15.21 v25.93,15.24 v20.19,15.24 19.18,14.22 19.18,5.59 18.54,4.95 13.59,4.95 12.86,4.22 ROUTER.7
MOSI  (via drill 0.33)
  Top 0.254: U1.15 19.32,17.01 v17.55,15.24 | R12.1 26.49,36.27 v26.49,35.46
  Bottom 0.254: ROUTER.8 | v17.55,15.24 19.32,17.01 19.93,17.01 20.7,17.78 20.7,18.54 21.97,19.81 24.77,19.81 26.8,21.84 26.8,35.15 v26.49,35.46
  Bottom 0.305: ROUTER.8 13.76,6.27 14.1,6.6 14.1,14.61 14.73,15.24 v17.55,15.24
MS14_RESET
  Top 0.254: R8.1 12.82,14.48 10.03,14.48 8.26,12.7 8.26,9.14 6.48,7.37 6.48,5.03 ROUTER.3
N$1
  Top 0.305: U1.8 11.6,19.8 R2.2 11.01,19.22 Q1.3
N$2
  Top 0.305: U1.7 11.63,20.6 R2.1 11.01,21.22 Q1.1
N$4
  Top 0.254: R4.2 R3.2 16.13,9.73 T1.2
N$5
  Top 0.406: F1.2 25.65,56.41 25.65,56.27
  Top 0.813: 26.04,56.27 25.65,56.27 SENSOR.14
N$8
  Top 0.305: R5.1 R15.2 10.88,9.7 T2.2
N$9
  Top 0.203: T3.2 25.64,10.35 R30.2 R31.2
SCK  (via drill 0.33)
  Top 0.254: R11.1 v26.54,37.39 | v21.61,18.39 U1.17
  Bottom 0.254: v26.54,37.39 27.3,36.63 27.3,21.54 24.15,18.39 v21.61,18.39 21.59,18.36 21.59,17.78 18.03,14.22 17.14,14.22
  Bottom 0.305: ROUTER.10 15.4,12.48 17.14,14.22
SENSOR_LED
  Top 0.203: ROUTER.16 25,8.25 T3.1
UART_RXD
  Top 0.203: U2.2 21.8,7.59 ROUTER.14
UART_RXD1  (via drill 0.33)
  Top 0.254: U2.6 22.3,16.38 24.26,18.34 v24.26,25.15 | U1.30 16.13,26.11 16.84,25.4 19.3,25.4 19.56,25.15 v20.07,25.15
  Bottom 0.254: v24.26,25.15 v20.07,25.15
UART_TXD
  Top 0.203: ROUTER.13 21.77,5.02 21.77,6.91 22.3,7.44 U2.3
UART_TXD1  (via drill 0.33)  (1 unrouted)
  Top 0.254: U1.31 15.32,25.81 16.56,24.56 v18.95,24.56 | U2.5 22.8,16.07 25.22,18.49 v25.22,22.76
  Bottom 0.254: 25.15,22.73 22.1,22.73 20.7,24.13 19.38,24.13 v18.95,24.56
VCC  (via drill 0.6)
  Top 0.813: v1.78,40.26 1.8,40.26 1.8,36.93 2.97,36.93 2.97,32.84 3.3,32.51 K2.2.2 | v1.78,50.55 1.78,53.37 F2.1
  Bottom 0.813: v1.78,40.26 1.14,40.26 1.14,50.55 v1.78,50.55
VOUT
  Top 0.254: U10.1 9.46,52 10.41,52.96 10.41,54.9 SENSOR.4
  Top 0.813: SENSOR.4 9.03,56.29 9.03,57.64 8.64,58.04 2.55,58.04 F2.2

### Text on the board
tDocu: +5V | VCC | 3.3V
bDocu: LoRa G v 1.3 | OPEN-SOURCE | WWW.DRAGINO.COM | LoRa MODEL. | 433 MHZ | 868 MHZ | 915 MHZ